# EAGLE design Mainboard (EAGLE 9.1.1)
AUTOR: Alexander Miller; PROJECT: HeRo Mini

## Sheet 1 of 4
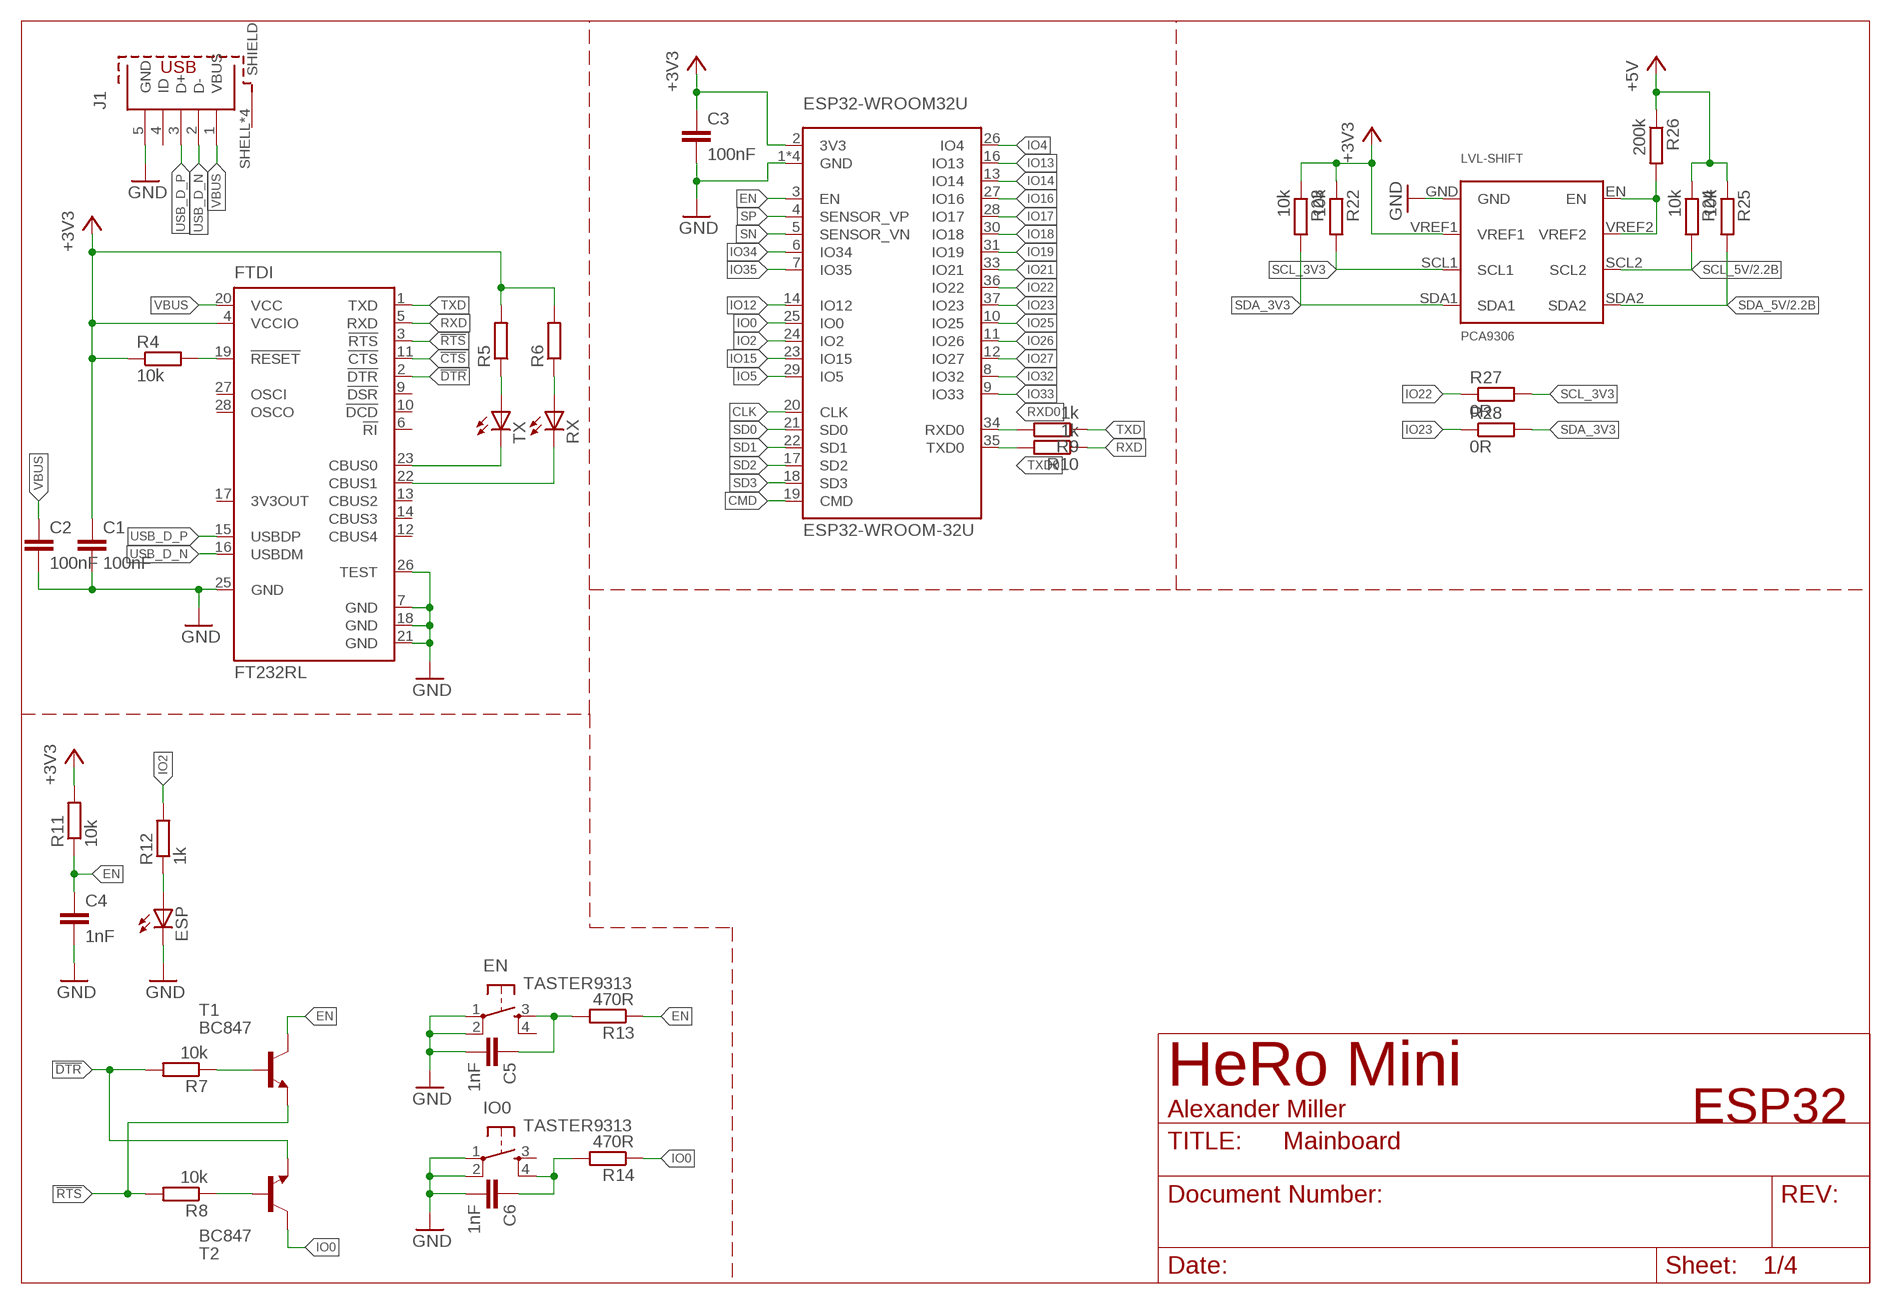
[diagram p0: schematic, sheet 1]

### Parts
C1  100nF  C-EUC0805  [C0805]
C2  100nF  C-EUC0805  [C0805]
C3  100nF  C-EUC0805  [C0805]
C4  1nF  C-EUC0805  [C0805]
C5  1nF  C-EUC0805  [C0805]
C6  1nF  C-EUC0805  [C0805]
EN  TASTER9313  [TASTER9313]
ESP  LEDCHIP-LED0805  [CHIP-LED0805]
ESP32-WROOM32U  ESP32-WROOM-32U  [ESP32-WROOM-32U]
FTDI  FT232RL  [SSOP28]
IO0  TASTER9313  [TASTER9313]
J1  629105136821  [629105136821]
LVL-SHIFT  PCA9306  [PCA9306]
R4  10k  R-EU_R0805  [R0805]
R5  R-EU_R0805  [R0805]
R6  R-EU_R0805  [R0805]
R7  10k  R-EU_R0805  [R0805]
R8  10k  R-EU_R0805  [R0805]
R9  1k  R-EU_R0805  [R0805]
R10  1k  R-EU_R0805  [R0805]
R11  10k  R-EU_R0805  [R0805]
R12  1k  R-EU_R0805  [R0805]
R13  470R  R-EU_R0805  [R0805]
R14  470R  R-EU_R0805  [R0805]
R22  10k  R-EU_R0805  [R0805]
R23  10k  R-EU_R0805  [R0805]
R24  10k  R-EU_R0805  [R0805]
R25  10k  R-EU_R0805  [R0805]
R26  200k  R-EU_R0805  [R0805]
R27  0R  R-EU_R0805  [R0805]
R28  0R  R-EU_R0805  [R0805]
RX  LEDCHIP-LED0805  [CHIP-LED0805]
T1  BC847  [SOT23]
T2  BC847  [SOT23]
TX  LEDCHIP-LED0805  [CHIP-LED0805]

### Nets
!CTS: FTDI.11(!CTS)
!DTR: FTDI.2(!DTR) R7.2 T2.2(E)
!RTS: FTDI.3(!RTS) R8.2 T1.2(E)
+3V3: C1.1 C3.1 ESP32-WROOM32U.2(3V3) FTDI.4(VCCIO) LVL-SHIFT.VREF1 R4.1 R5.2 R6.2 R11.2 R22.1 R23.1 ; also sheet 4
+5V: R24.1 R25.1 R26.1 ; also sheet 2,3,4
CLK: ESP32-WROOM32U.20(CLK)
CMD: ESP32-WROOM32U.19(CMD)
EN: C4.1 ESP32-WROOM32U.3(EN) R11.1 R13.1 T1.3(C)
GND: C1.2 C2.2 C3.2 C4.2 C5.2 C6.2 EN.1(P) EN.2(P1) ESP32-WROOM32U.1(GND) ESP32-WROOM32U.15(GND) ESP32-WROOM32U.38(GND) ESP32-WROOM32U.39(GND) ESP.C FTDI.7(GND) FTDI.18(GND) FTDI.21(GND) FTDI.25(GND) FTDI.26(TEST) IO0.1(P) IO0.2(P1) J1.5(GND) LVL-SHIFT.GND ; also sheet 2,3,4
IO0: ESP32-WROOM32U.25(IO0) R14.1 T2.3(C)
IO2: ESP32-WROOM32U.24(IO2) R12.2
IO4: ESP32-WROOM32U.26(IO4)
IO5: ESP32-WROOM32U.29(IO5)
IO12: ESP32-WROOM32U.14(IO12)
IO13: ESP32-WROOM32U.16(IO13)
IO14: ESP32-WROOM32U.13(IO14)
IO15: ESP32-WROOM32U.23(IO15)
IO16: ESP32-WROOM32U.27(IO16)
IO17: ESP32-WROOM32U.28(IO17)
IO18: ESP32-WROOM32U.30(IO18)
IO19: ESP32-WROOM32U.31(IO19)
IO21: ESP32-WROOM32U.33(IO21)
IO22: ESP32-WROOM32U.36(IO22) R27.1
IO23: ESP32-WROOM32U.37(IO23) R28.1
IO25: ESP32-WROOM32U.10(IO25)
IO26: ESP32-WROOM32U.11(IO26)
IO27: ESP32-WROOM32U.12(IO27)
IO32: ESP32-WROOM32U.8(IO32)
IO33: ESP32-WROOM32U.9(IO33)
IO34: ESP32-WROOM32U.6(IO34)
IO35: ESP32-WROOM32U.7(IO35)
N$3: FTDI.19(!RESET) R4.2
N$4: FTDI.23(CBUS0) TX.C
N$5: FTDI.22(CBUS1) RX.C
N$6: R5.1 TX.A
N$7: R6.1 RX.A
N$8: R7.1 T1.1(B)
N$9: R8.1 T2.1(B)
N$12: ESP.A R12.1
N$13: C5.1 EN.3(S) R13.2
N$14: C6.1 IO0.4(S1) R14.2
N$23: LVL-SHIFT.EN LVL-SHIFT.VREF2 R26.2
RXD: FTDI.5(RXD) R10.1
RXD0: ESP32-WROOM32U.34(RXD0) R9.2
SCL_3V3: LVL-SHIFT.SCL1 R22.2 R27.2
SCL_5V: LVL-SHIFT.SCL2 R24.2 ; also sheet 2,3
SD0: ESP32-WROOM32U.21(SD0)
SD1: ESP32-WROOM32U.22(SD1)
SD2: ESP32-WROOM32U.17(SD2)
SD3: ESP32-WROOM32U.18(SD3)
SDA_3V3: LVL-SHIFT.SDA1 R23.2 R28.2
SDA_5V: LVL-SHIFT.SDA2 R25.2 ; also sheet 2,3
SN: ESP32-WROOM32U.5(SENSOR_VN)
SP: ESP32-WROOM32U.4(SENSOR_VP)
TXD: FTDI.1(TXD) R9.1
TXD0: ESP32-WROOM32U.35(TXD0) R10.2
USB_D_N: FTDI.16(USBDM) J1.2(D-)
USB_D_P: FTDI.15(USBDP) J1.3(D+)
VBUS: C2.1 FTDI.20(VCC) J1.1(VBUS)
Unconnected: EN.4(S1) FTDI.6(!RI) FTDI.9(!DSR) FTDI.10(!DCD) FTDI.12(CBUS4) FTDI.13(CBUS2) FTDI.14(CBUS3) FTDI.17(3V3OUT) FTDI.27(OSCI) FTDI.28(OSCO) IO0.3(S) J1.4(ID) J1.SHELL1(SHIELD) J1.SHELL2(SHIELD) J1.SHELL3(SHIELD) J1.SHELL(SHIELD)

### Notes on the sheet
- ESP32

## Sheet 2 of 4
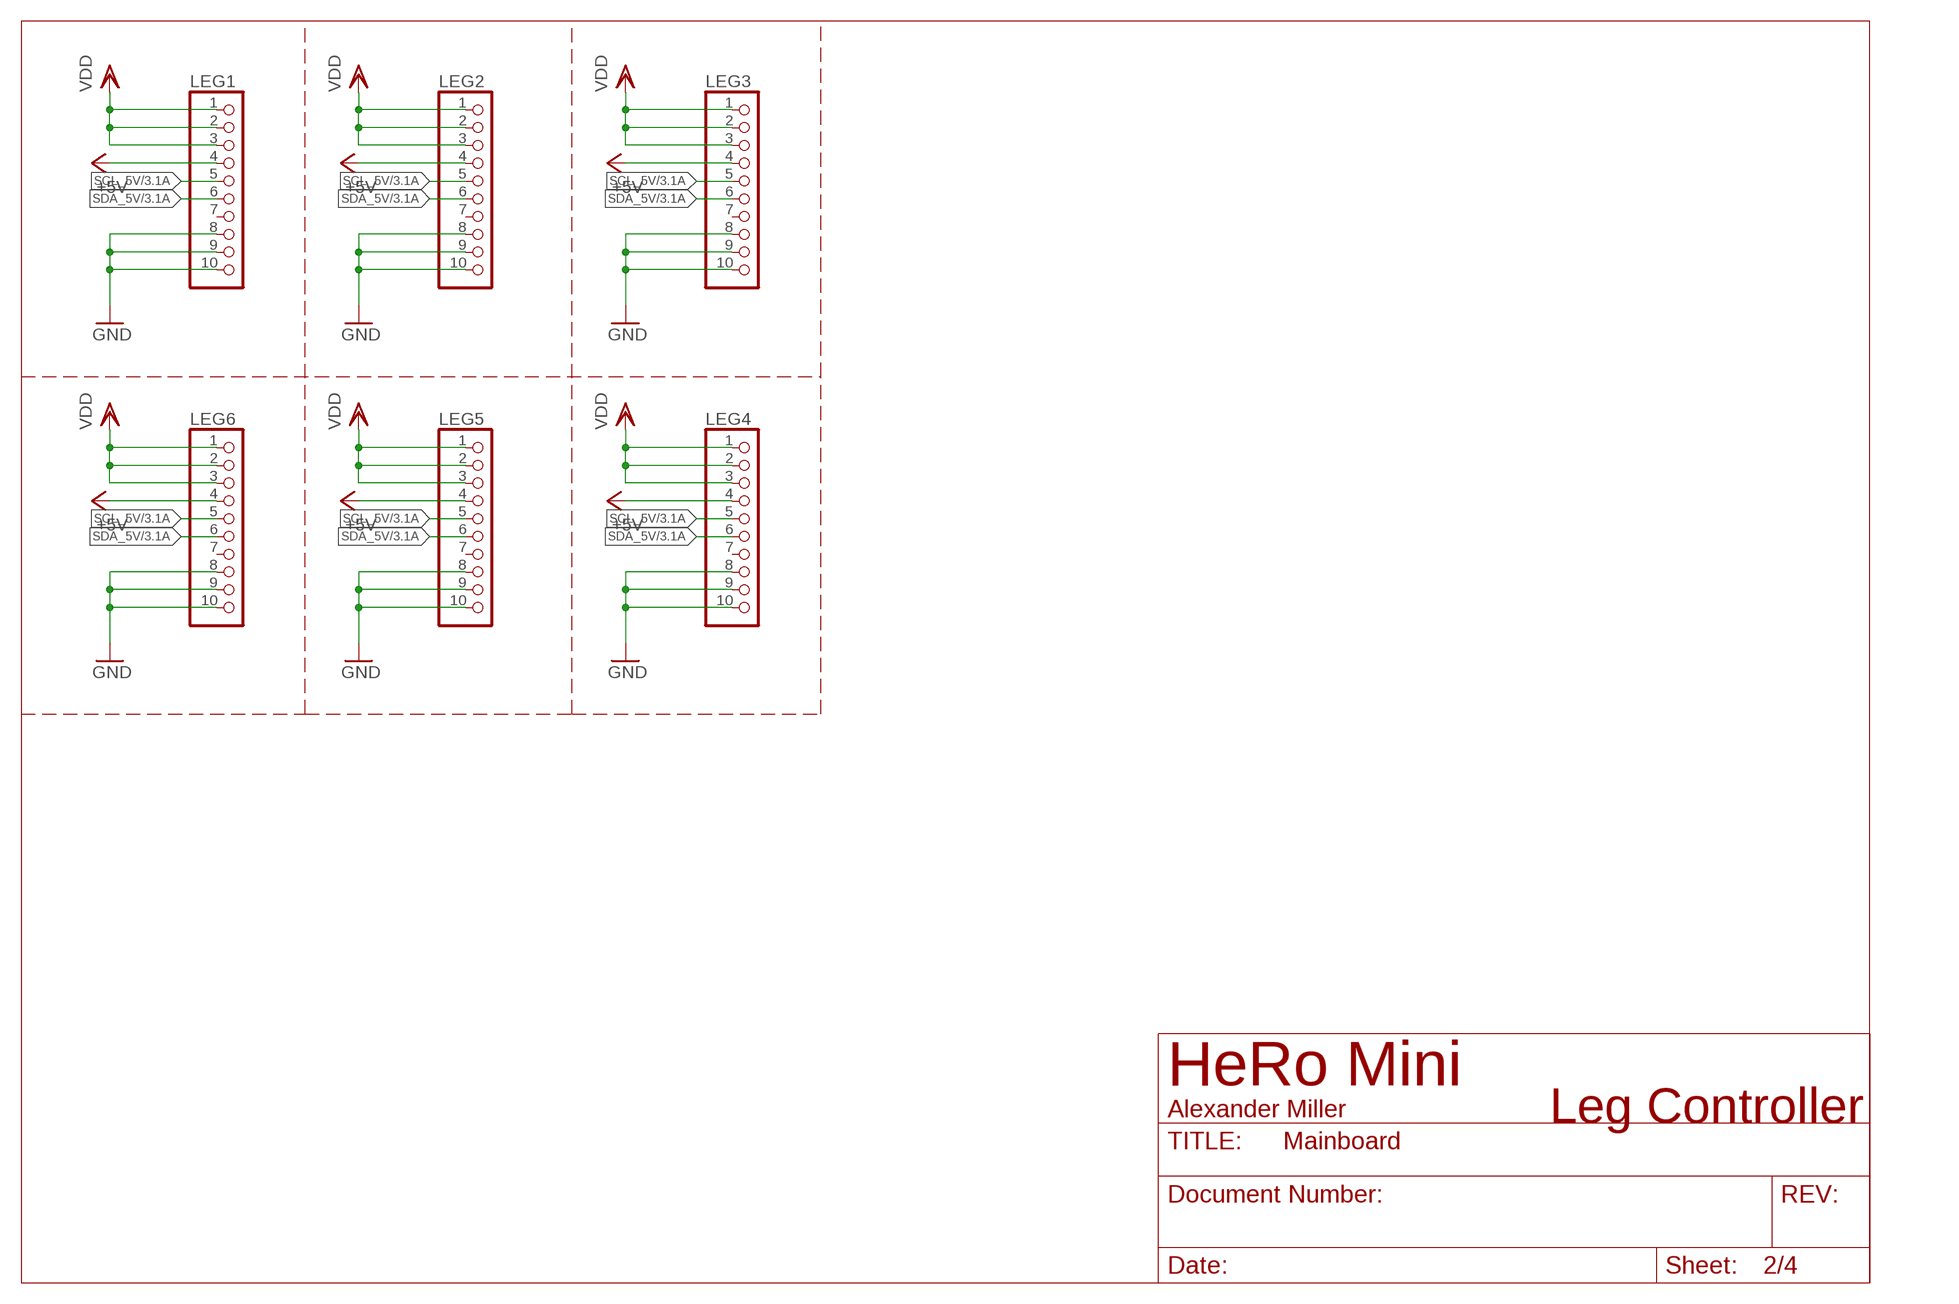
[diagram p1: schematic, sheet 2]

### Parts
LEG1  PINHD-1X10  [1X10]
LEG2  PINHD-1X10  [1X10]
LEG3  PINHD-1X10  [1X10]
LEG4  PINHD-1X10  [1X10]
LEG5  PINHD-1X10  [1X10]
LEG6  PINHD-1X10  [1X10]

### Nets
+5V: LEG1.4 LEG2.4 LEG3.4 LEG4.4 LEG5.4 LEG6.4 ; also sheet 1,3,4
GND: LEG1.8 LEG1.9 LEG1.10 LEG2.8 LEG2.9 LEG2.10 LEG3.8 LEG3.9 LEG3.10 LEG4.8 LEG4.9 LEG4.10 LEG5.8 LEG5.9 LEG5.10 LEG6.8 LEG6.9 LEG6.10 ; also sheet 1,3,4
SCL_5V: LEG1.5 LEG2.5 LEG3.5 LEG4.5 LEG5.5 LEG6.5 ; also sheet 1,3
SDA_5V: LEG1.6 LEG2.6 LEG3.6 LEG4.6 LEG5.6 LEG6.6 ; also sheet 1,3
VDD: LEG1.1 LEG1.2 LEG1.3 LEG2.1 LEG2.2 LEG2.3 LEG3.1 LEG3.2 LEG3.3 LEG4.1 LEG4.2 LEG4.3 LEG5.1 LEG5.2 LEG5.3 LEG6.1 LEG6.2 LEG6.3 ; also sheet 4
Unconnected: LEG1.7 LEG2.7 LEG3.7 LEG4.7 LEG5.7 LEG6.7

### Notes on the sheet
- Leg Controller

## Sheet 3 of 4
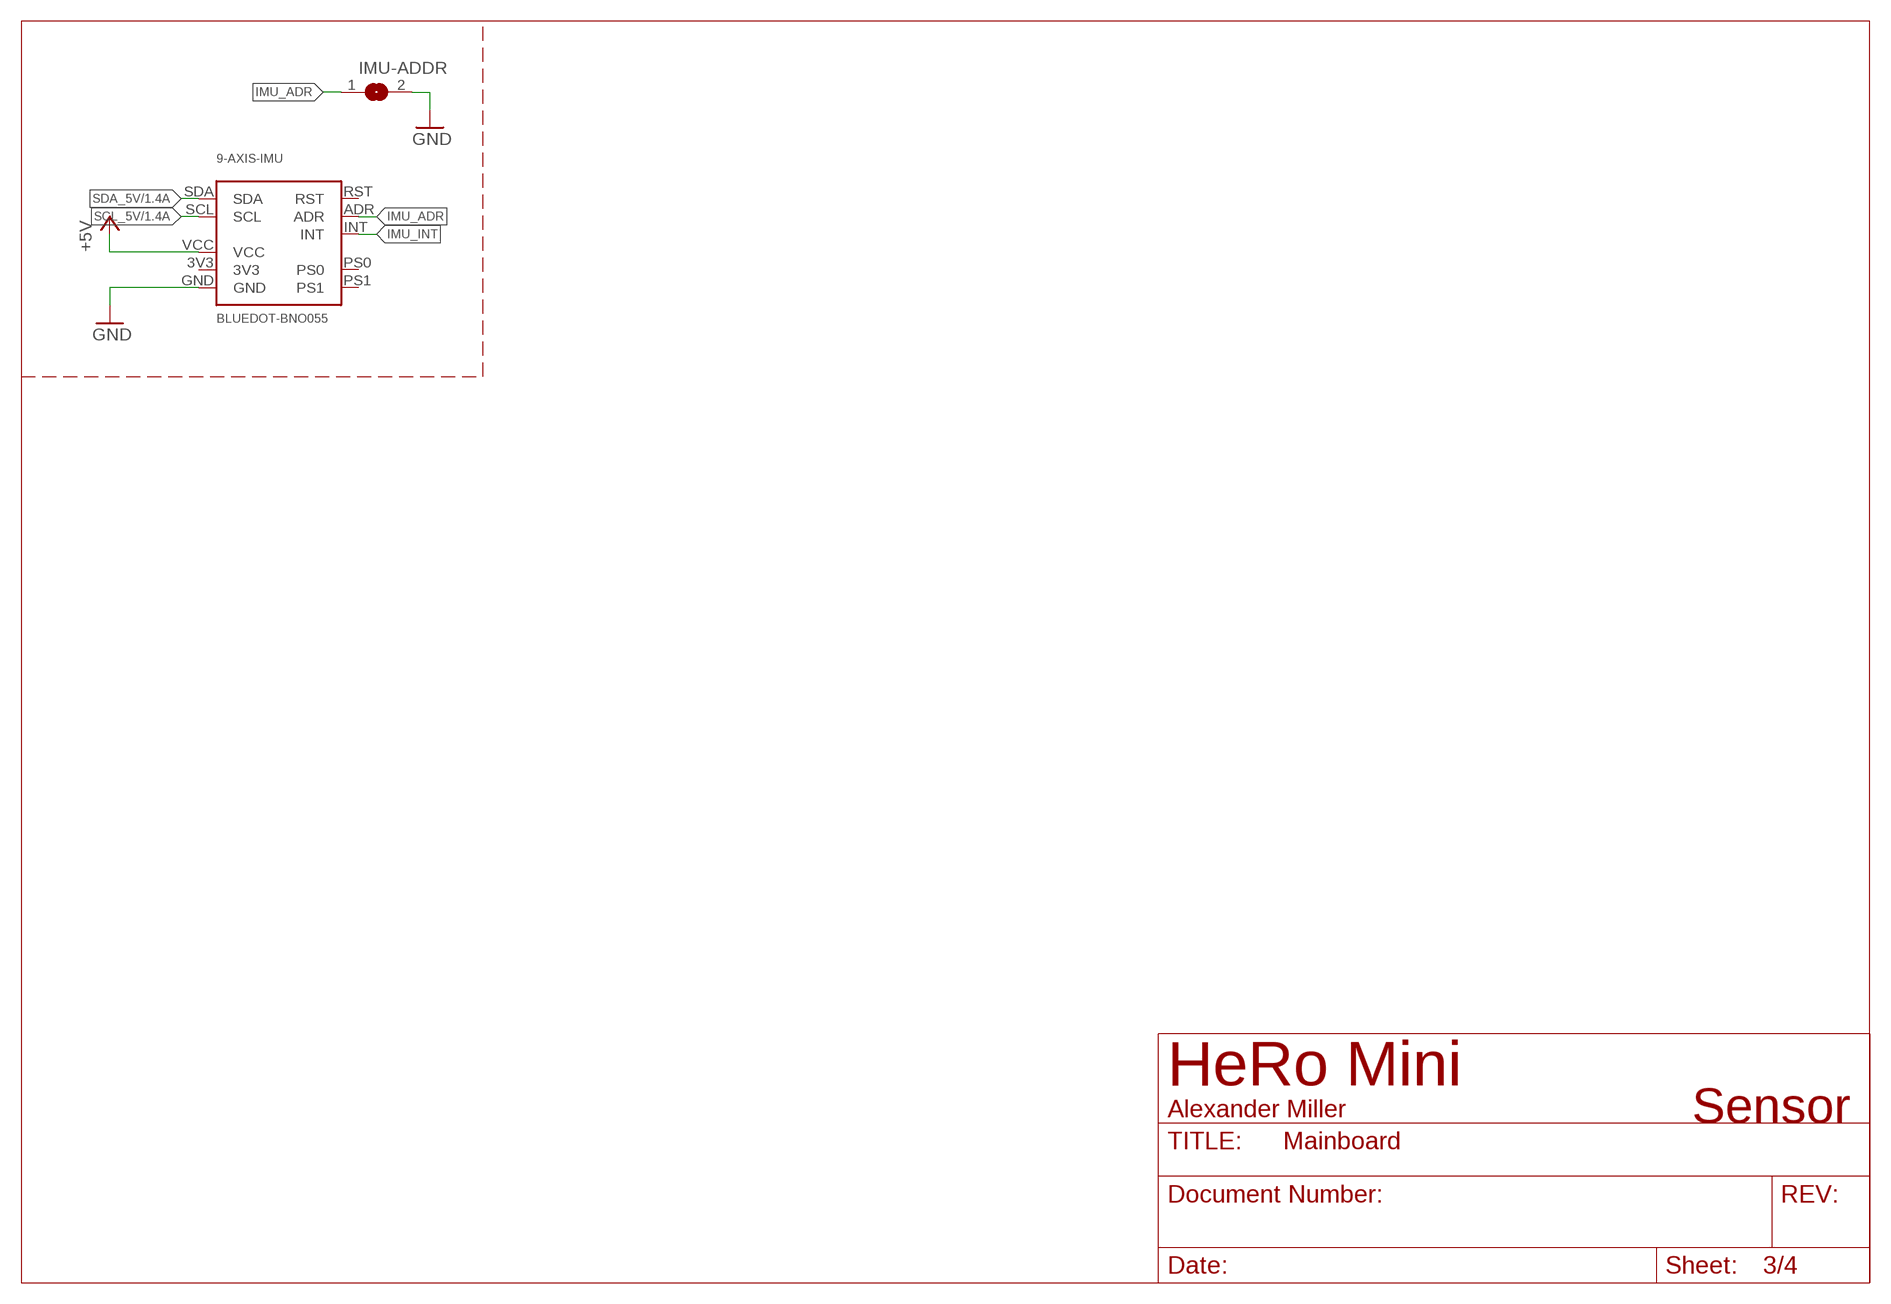
[diagram p2: schematic, sheet 3]

### Parts
9-AXIS-IMU  BLUEDOT-BNO055  [BLUEDOT-BNO055]
IMU-ADDR  SJ  [SJ]

### Nets
+5V: 9-AXIS-IMU.VCC ; also sheet 1,2,4
GND: 9-AXIS-IMU.GND IMU-ADDR.2 ; also sheet 1,2,4
IMU_ADR: 9-AXIS-IMU.ADR IMU-ADDR.1
IMU_INT: 9-AXIS-IMU.INT
SCL_5V: 9-AXIS-IMU.SCL ; also sheet 1,2
SDA_5V: 9-AXIS-IMU.SDA ; also sheet 1,2
Unconnected: 9-AXIS-IMU.3V3 9-AXIS-IMU.PS0 9-AXIS-IMU.PS1 9-AXIS-IMU.RST

### Notes on the sheet
- Sensor

## Sheet 4 of 4
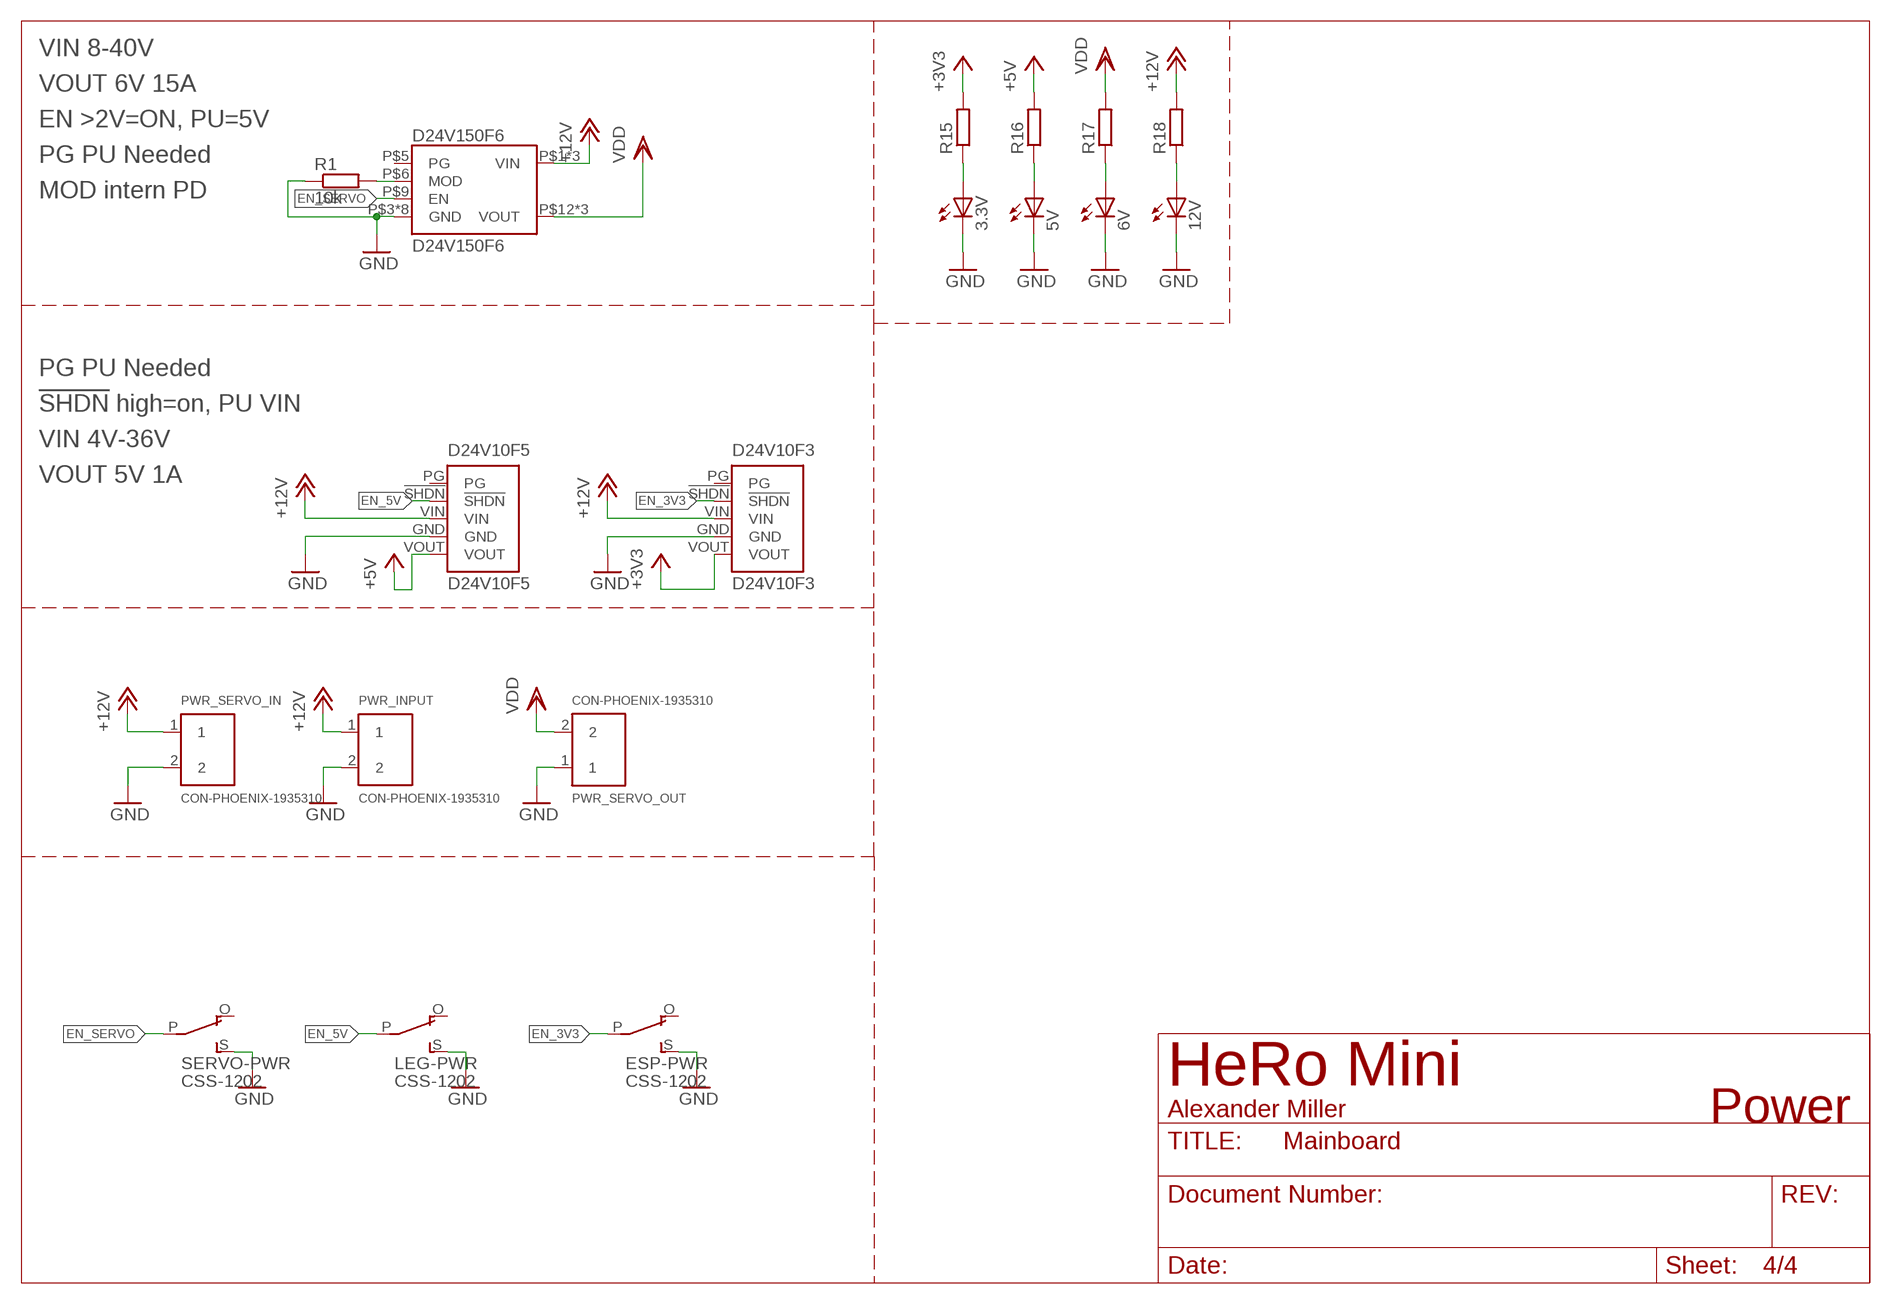
[diagram p3: schematic, sheet 4]

### Parts
3.3V  LEDCHIP-LED0805  [CHIP-LED0805]
5V  LEDCHIP-LED0805  [CHIP-LED0805]
6V  LEDCHIP-LED0805  [CHIP-LED0805]
12V  LEDCHIP-LED0805  [CHIP-LED0805]
D24V10F3  D24V10F3  [D24V10F5]
D24V10F5  D24V10F5  [D24V10F5]
D24V150F6  D24V150F6  [D24V150F6]
ESP-PWR  CSS-1202  [CSS-1202]
LEG-PWR  CSS-1202  [CSS-1202]
PWR_INPUT  CON-PHOENIX-1935310  [CON-PHOENIX-1935310]
PWR_SERVO_IN  CON-PHOENIX-1935310  [CON-PHOENIX-1935310]
PWR_SERVO_OUT  CON-PHOENIX-1935310  [CON-PHOENIX-1935310]
R1  10k  R-EU_R0805  [R0805]
R15  R-EU_R0805  [R0805]
R16  R-EU_R0805  [R0805]
R17  R-EU_R0805  [R0805]
R18  R-EU_R0805  [R0805]
SERVO-PWR  CSS-1202  [CSS-1202]

### Nets
+3V3: D24V10F3.VOUT R15.2 ; also sheet 1
+5V: D24V10F5.VOUT R16.2 ; also sheet 1,2,3
+12V: D24V10F3.VIN D24V10F5.VIN D24V150F6.P$1(VIN) D24V150F6.P$2(VIN) D24V150F6.P$17(VIN) PWR_INPUT.1 PWR_SERVO_IN.1 R18.2
EN_3V3: D24V10F3.!SHDN ESP-PWR.P
EN_5V: D24V10F5.!SHDN LEG-PWR.P
EN_SERVO: D24V150F6.P$9(EN) SERVO-PWR.P
GND: 3.3V.C 5V.C 6V.C 12V.C D24V10F3.GND D24V10F5.GND D24V150F6.P$3(GND) D24V150F6.P$4(GND) D24V150F6.P$7(GND) D24V150F6.P$8(GND) D24V150F6.P$10(GND) D24V150F6.P$11(GND) D24V150F6.P$14(GND) D24V150F6.P$16(GND) ESP-PWR.S LEG-PWR.S PWR_INPUT.2 PWR_SERVO_IN.2 PWR_SERVO_OUT.1 R1.1 SERVO-PWR.S ; also sheet 1,2,3
N$2: D24V150F6.P$6(MOD) R1.2
N$15: 5V.A R16.1
N$16: 6V.A R17.1
N$17: 3.3V.A R15.1
N$18: 12V.A R18.1
VDD: D24V150F6.P$12(VOUT) D24V150F6.P$13(VOUT) D24V150F6.P$15(VOUT) PWR_SERVO_OUT.2 R17.2 ; also sheet 2
Unconnected: D24V10F3.PG D24V10F5.PG D24V150F6.P$5(PG) ESP-PWR.O LEG-PWR.O SERVO-PWR.O

### Notes on the sheet
- VIN 8-40V
- VOUT 6V 15A
- EN >2V=ON, PU=5V
- PG PU Needed
- MOD intern PD
- PG PU Needed
- !SHDN! high=on, PU VIN
- VIN 4V-36V
- VOUT 5V 1A
- Power

## Library data of the parts
3.3V 5V 6V 12V ESP RX TX = led:LED: LED OSRAM: - CHIPLED LG R971, LG N971, LY N971, LG Q971, LY Q971, LO R971, LY R971 LH N974, LH R974 LS Q976, LO Q976, LY Q976 LO Q996 - Hyper CHIPLED LW Q18S LB Q993, LB Q99A, LB R99A - SideLED LS A670, LO A670, LY A670, LG A670, LP A670 LB A673, LV A673, LT A673, LW A673 LH A674 LY A675 LS A676, LA A676, LO A676, LY A676, LW A676 LS A679, LY A679, LG A679 - Hyper Micro SIDELED® LS Y876, LA Y876, LO Y876, LY Y876 LT Y87S - SmartLED LW L88C, LW L88S LB L89C, LB L89S, LG L890 LS L89K, LO L89K, LY L89K LS L896, LA L896, LO L896, LY L896 - TOPLED LS T670, LO T670, LY T670, LG T670, LP T670 LSG T670, LSP T670, LSY T670, LOP T670, LYG T670 LG T671, LOG T671, LSG T671 LB T673, LV T673, LT T673, LW T673 LH T674 LS T676, LA T676, LO T676, LY T676, LB T676, LH T676, LSB T676, LW T676 LB T67C, LV T67C, LT T67C, LS T67K, LO T67K, LY T67K, LW E67C LS E67B, LA E67B, LO E67B, LY E67B, LB E67C, LV E67C, LT E67C LW T67C LS T679, LY T679, LG T679 LS T770, LO T770, LY T770, LG T770, LP T770 LB T773, LV T773, LT T773, LW T773 LH T774 LS E675, LA E675, LY E675, LS T675 LS T776, LA T776, LO T776, LY T776, LB T776 LHGB T686 LT T68C, LB T68C - Hyper Mini TOPLED® LB M676 - Mini TOPLED Santana® LG M470 LS M47K, LO M47K, LY M47K Source: http://www.osram.convergy.de LUXEON: - LUMILED® LXK2-PW12-R00, LXK2-PW12-S00, LXK2-PW14-U00, LXK2-PW14-V00 LXK2-PM12-R00, LXK2-PM12-S00, LXK2-PM14-U00 LXK2-PE12-Q00, LXK2-PE12-R00, LXK2-PE12-S00, LXK2-PE14-T00, LXK2-PE14-U00 LXK2-PB12-K00, LXK2-PB12-L00, LXK2-PB12-M00, LXK2-PB14-N00, LXK2-PB14-P00, LXK2-PB14-Q00 LXK2-PR12-L00, LXK2-PR12-M00, LXK2-PR14-Q00, LXK2-PR14-R00 LXK2-PD12-Q00, LXK2-PD12-R00, LXK2-PD12-S00 LXK2-PH12-R00, LXK2-PH12-S00 LXK2-PL12-P00, LXK2-PL12-Q00, LXK2-PL12-R00 Source: www.luxeon.com KINGBRIGHT: KA-3528ASYC Source: www.kingbright.com
9-AXIS-IMU = HeRo:BLUEDOT-BNO055
C1-C6 = rcl:C-EU: CAPACITOR, European symbol; SPICEPREFIX: C
D24V10F3 = HeRo:D24V10F3
D24V10F5 = HeRo:D24V10F5
D24V150F6 = HeRo:D24V150F6
EN IO0 = HeRo:TASTER9313
ESP32-WROOM32U = HeRo:ESP32-WROOM-32U
ESP-PWR LEG-PWR SERVO-PWR = HeRo:CSS-1202
FTDI = ftdichip:FT232R: Source: http://www.ftdichip.com/Documents/DataSheets/DS_FT232R_v104.pdf; MPN: FT232RL; OC_FARNELL: 1146032; OC_NEWARK: 91K9918
IMU-ADDR = jumper:SJ: SMD solder JUMPER
J1 = InputOutputIO (rev18a):629105136821: WR-COM SMT Horizontal 5 Contacts Micro USB Type B,5 pins=>Code : Con_I-O_COM_MicroUSB_629105136821 <http://katalog.we-online.de/media/images/eican/Con_I-O_COM_MicroUSB_629105136821_pf2.jpg> Details see: http://katalog.we-online.de/en/em/COM_MICRO_SMT_TYPE_B_HORIZONTAL/629105136821?m Created 2014-07-09, Karrer Zheng 2014 (C) Würth Elektronik
LEG1-LEG6 = pinhead:PINHD-1X10: PIN HEADER
LVL-SHIFT = HeRo:PCA9306
PWR_INPUT PWR_SERVO_IN PWR_SERVO_OUT = HeRo:CON-PHOENIX-1935310
R1 R4-R18 R22-R28 = rcl:R-EU_: RESISTOR, European symbol; SPICEPREFIX: R
T1 T2 = transistor:BC847: NPN TRANSISTOR

## Board
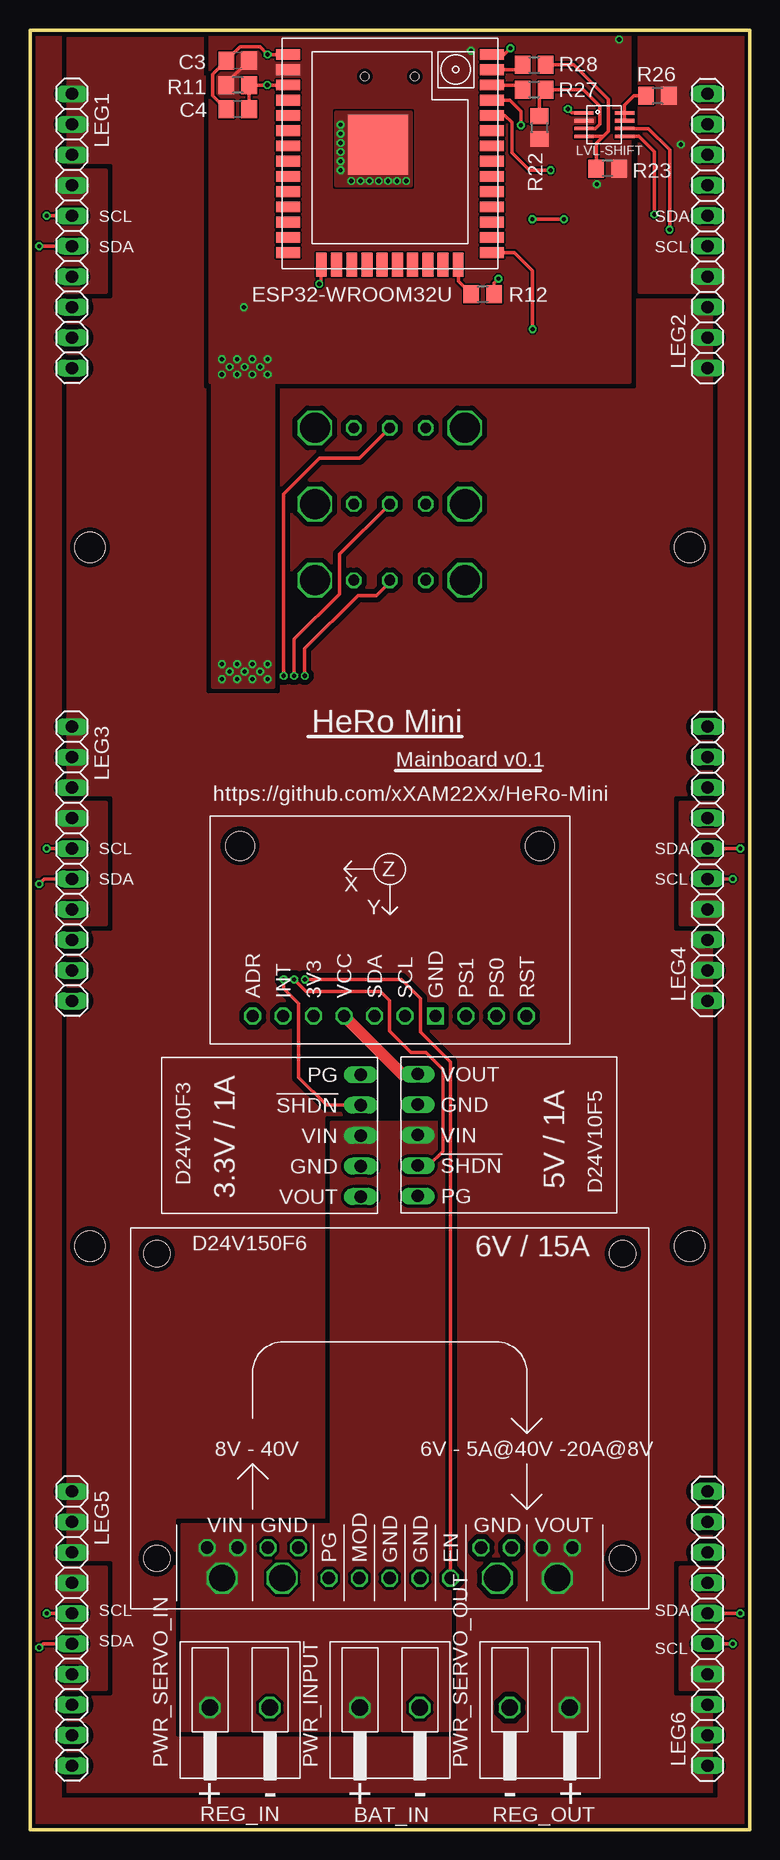
[diagram p4: board, top side]
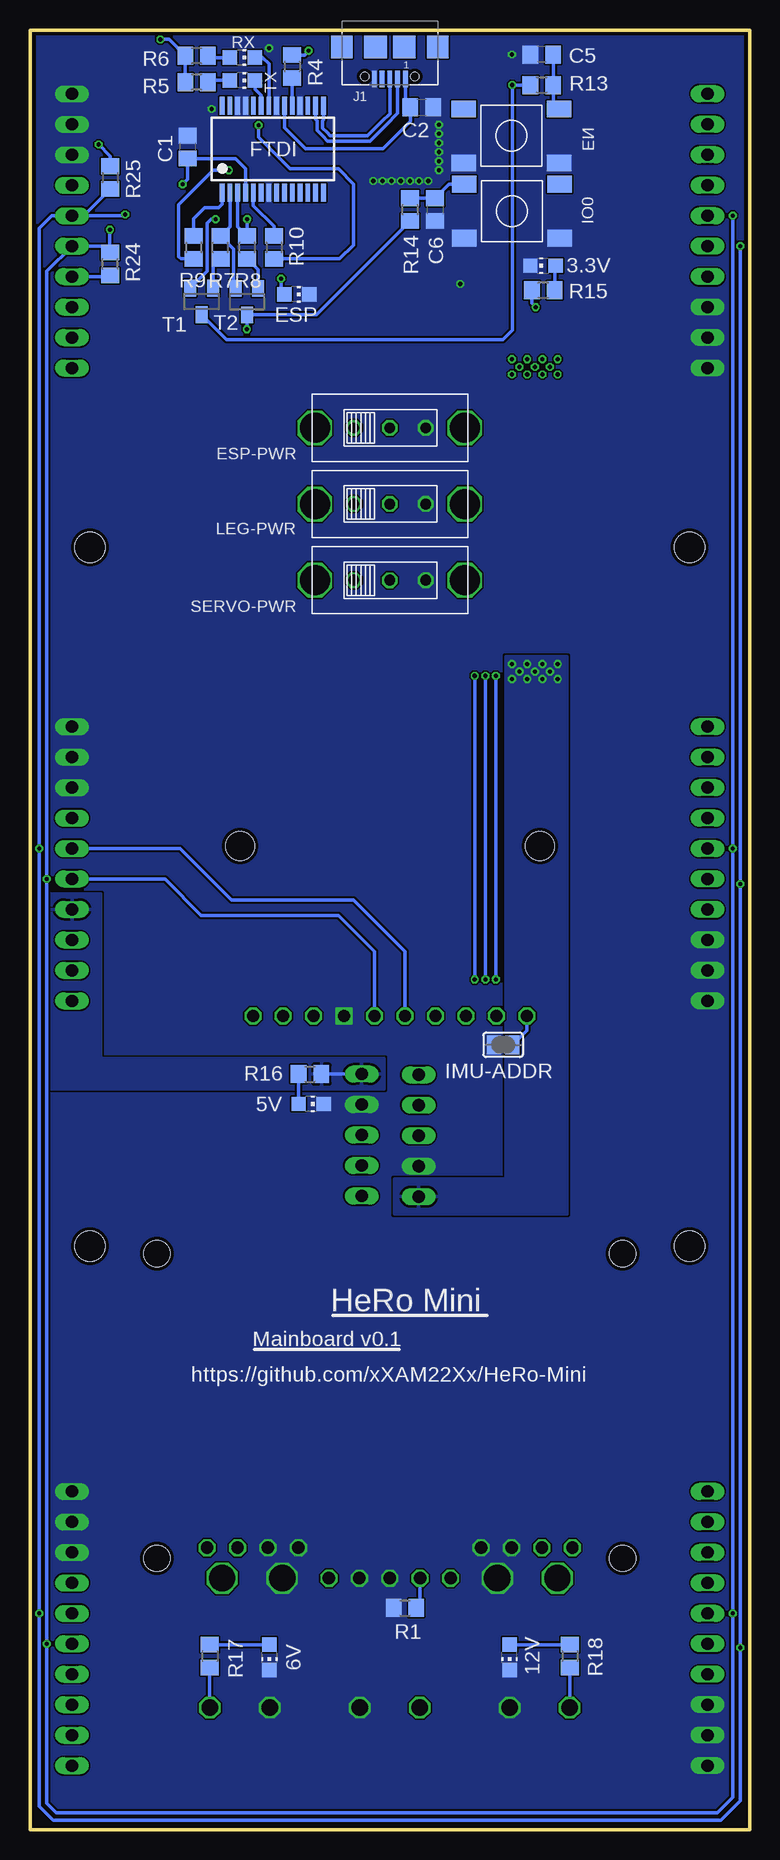
[diagram p5: board, bottom side, seen from below]

Size 60 x 150 mm. Coordinates in mm from the lower left corner, seen from the top.
Outline: 0,0 0,150 60,150 60,0 0,0
Copper layers (1*16): Top 0.035mm / dielectric 1.5mm / Bottom 0.035mm
Design rules "PCB-POOL Standard": minimum track width 0.15mm, minimum drill 0.3mm, track to track 0.15mm, track to pad 0.15mm, pad to pad 0.15mm, via to via 0.15mm, smd to smd 0.15mm, copper to edge 0.3mm, drill to drill 0.2mm, minimum pad ring 0.2mm, minimum via ring 0.15mm, stop-mask expansion 0.075mm, vias tented up to drill 0mil, thermal gap 0.2mm
Holes 2.5 mm at 5,106.88 55,106.88 5,48.62 55,48.62

### Footprints (pad centres in the part's own frame; a part is rotated, then mirrored left to right if it is on the bottom)
CHIP-LED0805 = smd 1.2 x 1.2: A 0,-1.05; C 0,1.05
BLUEDOT-BNO055 = drill 1.016 octagon: 3V3 -6.35,-7.2; ADR -11.43,-7.2; INT -8.89,-7.2; PS0 8.89,-7.2; PS1 6.35,-7.2; RST 11.4,-7.2; SCL 1.27,-7.2; SDA -1.27,-7.2; VCC -3.81,-7.2 | drill 1.016 square: GND 3.81,-7.2 | hole 2.4: -12.5,7; 12.5,7
C0805 = smd 1.3 x 1.5: 1 -0.95,0; 2 0.95,0
D24V10F5 = drill 1.016 long: !SHDN 2.54,-7.62; GND -2.54,-7.62; PG 5.08,-7.62; VIN 0,-7.62; VOUT -5.08,-7.62
D24V150F6 = drill 1.016 octagon: P$1 -15.24,-10.795; P$2 -12.7,-10.795; P$3 -10.16,-10.795; P$4 -7.62,-10.795; P$5 -5.08,-13.335; P$6 -2.54,-13.335; P$7 0,-13.335; P$8 2.54,-13.335; P$9 5.08,-13.335; P$10 7.62,-10.795; P$11 10.16,-10.795; P$12 12.7,-10.795; P$13 15.24,-10.795 | drill 2.184 octagon: P$14 8.966,-13.335; P$15 13.97,-13.335; P$16 -8.966,-13.335; P$17 -13.97,-13.335 | hole 2.184: -19.431,13.716; -19.431,-11.684; 19.431,-11.684; 19.431,13.716
TASTER9313 = smd 2.05 x 1.4: 1 -3.975,2.25; 2 3.975,2.25; 3 -3.975,-2.25; 4 3.975,-2.25
ESP32-WROOM-32U = smd 2 x 0.9: 1 -8.5,8.255; 2 -8.5,6.985; 3 -8.5,5.715; 4 -8.5,4.445; 5 -8.5,3.175; 6 -8.5,1.905; 7 -8.5,0.635; 8 -8.5,-0.635; 9 -8.5,-1.905; 10 -8.5,-3.175; 11 -8.5,-4.445; 12 -8.5,-5.715; 13 -8.5,-6.985; 14 -8.5,-8.255; 25 8.5,-8.255; 26 8.5,-6.985; 27 8.5,-5.715; 28 8.5,-4.445; 29 8.5,-3.175; 30 8.5,-1.905; 31 8.5,-0.635; 32 8.5,0.635; 33 8.5,1.905; 34 8.5,3.175; 35 8.5,4.445; 36 8.5,5.715; 37 8.5,6.985; 38 8.5,8.255 | smd 0.9 x 2: 15 -5.715,-9.255; 16 -4.445,-9.255; 17 -3.175,-9.255; 18 -1.905,-9.255; 19 -0.635,-9.255; 20 0.635,-9.255; 21 1.905,-9.255; 22 3.175,-9.255; 23 4.445,-9.255; 24 5.715,-9.255 | smd 5 x 5: 39 -1,0.755
CSS-1202 = drill 2.5 octagon: CASE1 -6.25,0; CASE2 6.25,0 | drill 0.9 octagon: O -3,0; P 0,0; S 3,0
SSOP28 = smd 0.4 x 1.5: 1 -4.225,-3.625; 2 -3.575,-3.625; 3 -2.925,-3.625; 4 -2.275,-3.625; 5 -1.625,-3.625; 6 -0.975,-3.625; 7 -0.325,-3.625; 8 0.325,-3.625; 9 0.975,-3.625; 10 1.625,-3.625; 11 2.275,-3.625; 12 2.925,-3.625; 13 3.575,-3.625; 14 4.225,-3.625; 15 4.225,3.625; 16 3.575,3.625; 17 2.925,3.625; 18 2.275,3.625; 19 1.625,3.625; 20 0.975,3.625; 21 0.325,3.625; 22 -0.325,3.625; 23 -0.975,3.625; 24 -1.625,3.625; 25 -2.275,3.625; 26 -2.925,3.625; 27 -3.575,3.625; 28 -4.225,3.625
SJ = smd 1.168 x 1.6: 1 -0.762,0; 2 0.762,0
629105136821 = smd 0.4 x 1.35: 1 -1.3,2.675; 2 -0.65,2.675; 3 0,2.675; 4 0.65,2.675; 5 1.3,2.675 | smd 1.8 x 1.9: SHELL -4,0; SHELL3 4,0 | smd 1.9 x 1.9: SHELL1 -1.2,0; SHELL2 1.2,0 | hole 0.7: -2.075,2.45; 2.075,2.45
1X10 = drill 1.016 long: 1 -11.43,0; 2 -8.89,0; 3 -6.35,0; 4 -3.81,0; 5 -1.27,0; 6 1.27,0; 7 3.81,0; 8 6.35,0; 9 8.89,0; 10 11.43,0
PCA9306 = smd 0.3 x 1.6: EN -0.975,1.7; GND -0.975,-1.7; SCL1 0.325,-1.7; SCL2 0.325,1.7; SDA1 0.975,-1.7; SDA2 0.975,1.7; VREF1 -0.325,-1.7; VREF2 -0.325,1.7
CON-PHOENIX-1935310 = drill 1.4 octagon: 1 -2.5,0; 2 2.5,0
R0805 = smd 1.3 x 1.5: 1 -0.95,0; 2 0.95,0
SOT23 = smd 1 x 1.4: 1 -0.95,-1.1; 2 0.95,-1.1; 3 0,1.1

### Placement (x,y rotation side)
3.3V  17.22,130.35 90 bottom
5V  36.55,60.48 270 bottom
6V  40.03,14.35 180 bottom
9-AXIS-IMU  30,75 0 top
12V  20.02,14.35 180 bottom
C1  46.84,140.23 90 bottom
C2  27.33,143.56 0 bottom
C3  17.32,147.45 180 top
C4  17.32,143.38 180 top
C5  17.32,147.96 180 bottom
C6  26.24,135.03 270 bottom
D24V10F3  19.96,57.84 90 top
D24V10F5  39.95,57.89 270 top
D24V150F6  30,34.29 0 top
EN  19.86,141.17 180 bottom
ESP  37.74,127.97 270 bottom
ESP32-WROOM32U  30,139.7 0 top
ESP-PWR  30,116.84 0 bottom
FTDI  39.75,140.08 0 bottom
IMU-ADDR  20.55,65.41 180 bottom
IO0  19.81,134.9 180 bottom
J1  30,148.59 180 bottom
LEG1  3.5,133.25 270 top
LEG2  56.5,133.25 90 top
LEG3  3.5,80.5 270 top
LEG4  56.5,80.5 90 top
LEG5  3.5,16.75 270 top
LEG6  56.5,16.75 90 top
LEG-PWR  30,110.49 0 bottom
LVL-SHIFT  47.88,142.11 270 top
PWR_INPUT  30,10.16 0 top
PWR_SERVO_IN  17.5,10.16 0 top
PWR_SERVO_OUT  42.5,10.16 0 top
R1  28.73,18.47 0 bottom
R4  38.13,146.96 270 bottom
R5  46.1,145.64 180 bottom
R6  46.1,147.85 180 bottom
R7  44.12,131.88 90 bottom
R8  41.88,131.88 90 bottom
R9  46.35,131.88 270 bottom
R10  39.65,131.88 270 bottom
R11  17.32,145.41 180 top
R12  37.74,127.97 180 top
R13  17.32,145.41 0 bottom
R14  28.3,135.03 90 bottom
R15  17.2,128.3 180 bottom
R16  36.65,62.97 0 bottom
R17  45.01,14.45 270 bottom
R18  14.99,14.45 270 bottom
R22  42.49,141.86 90 top
R23  48.16,138.46 180 top
R24  53.31,130.51 90 bottom
R25  53.31,137.69 270 bottom
R26  52.32,144.53 180 top
R27  42.04,145.03 0 top
R28  42.04,147.09 0 top
RX  42.29,147.7 270 bottom
SERVO-PWR  30,104.14 0 bottom
T1  45.69,127.38 180 bottom
T2  41.91,127.36 180 bottom
TX  42.29,145.8 270 bottom

### Tracks (layer width: path | path; a pad name or v marks a point on that pad's centre or on a via)
!DTR
  Bottom 0.305: FTDI.2 43.33,133.62 R7.2 43,131.71 43,128.6 T2.2
!RTS  (via drill 0.35)
  Top 0.305: v41.88,134.24 v44.53,134.24
  Bottom 0.305: FTDI.3 42.68,133.62 R8.2 v41.88,134.24 | v44.53,134.24 44.88,134.24 45.24,133.88 45.24,129.89 T1.2
+3V3  (via drill 0.35)
  Top 0.305: C3.1 16.37,145.55 R11.2
  Bottom 0.305: R4.1 37.12,147.91 v36.78,148.26 | v49.12,149.21 48.41,149.21 R6.2 R5.2 | FTDI.4 42.03,138.44 42.43,138.85 42.87,139.28 C1.1 46.84,137.57 v47.27,137.13 | R15.2 18.15,127.21 v17.83,126.9
  other vias: 16,122.56 17.27,122.56 18.54,122.56 19.81,122.56 19.81,121.28 18.54,121.28 17.27,121.28 16,121.28 16.64,121.92 17.91,121.92 19.18,121.92 16,97.16 17.27,97.16 18.54,97.16 19.81,97.16 19.81,95.89 18.54,95.89 17.27,95.89 16,95.89 16.64,96.52 17.91,96.52 19.18,96.52
  pour Top (rank 2, no thermals): 15,150 50,150 50,120.65 15,120.65
  pour Bottom: 15.24,97.79 20.32,97.79 20.32,54.23 29.59,54.23 29.59,51.31 15.24,51.31
  pour Top: 15.24,95.25 15.24,123.19 20.32,123.19 20.32,95.25
+5V  (via drill 0.35)
  Top 1.016: D24V10F5.VOUT 31.02,62.97 9-AXIS-IMU.VCC
  Bottom 0.305: R16.2 D24V10F5.VOUT | R25.1 53.31,139.5 v54.28,140.46 | R24.1 53.43,129.44 LEG2.4
  pour Top (no thermals): 2.54,150 0,150 0,0 60,0 60,150 57.46,150 50.8,150 50.8,128.14 57.46,128.14 57.46,85.6 54.23,85.6 54.23,75.44 57.46,75.44 57.46,21.84 54.23,21.84 54.23,11.68 57.46,11.68 57.46,2.54 2.54,2.54 2.54,11.68 6.35,11.68 6.35,21.84 2.54,21.84 2.54,75.44 6.35,75.44 6.35,85.6 2.54,85.6 2.54,128.14 6.35,128.14 6.35,138.3 2.54,138.3 2.54,148.59
  pour Bottom: 30.48,64.26 54.1,64.26 54.1,77.98 60,77.98 60,61.72 30.48,61.72
+12V
  Bottom 0.305: R18.2 14.99,10.17 PWR_SERVO_IN.1
  pour Top (isolate 0.254, no thermals): 12.7,25.4 25.15,25.4 25.15,58.93 35,58.93 35,30.48 35,16.51 35,8.26 12.7,8.26
EN  (via drill 0.35)
  Top 0.305: ESP32-WROOM32U.3 v19.79,145.41 R13.1 C4.1
  Bottom 0.305: T1.3 43.62,124.21 20.57,124.21 19.79,124.99 v19.79,145.41 R13.1
EN_3V3  (via drill 0.35)
  Top 0.305: D24V10F3.!SHDN 24.71,60.38 22.4,62.69 22.4,68.86 21.16,70.1 v21.16,70.87 | v21.16,96.16 21.16,111.33 24.13,114.3 27.46,114.3 ESP-PWR.P
  Bottom 0.305: v21.16,70.87 v21.16,96.16
EN_5V  (via drill 0.35)
  Top 0.305: D24V10F5.!SHDN 33.25,55.35 34.42,56.52 34.42,63.37 33.02,64.77 31.75,64.77 29.97,66.55 29.97,69.09 29.21,69.85 23.04,69.85 v22.02,70.87 | v22.02,96.16 22.02,99.21 25.81,103 25.81,105.41 25.81,106.3 LEG-PWR.P
  Bottom 0.305: v22.02,70.87 v22.02,96.16
EN_SERVO  (via drill 0.35)
  Top 0.305: D24V150F6.P$9 35.08,63.98 32.56,66.5 32.56,69.27 30.96,70.86 v22.91,70.86 | v22.91,96.16 22.91,98.42 27.36,102.87 28.91,102.87 30,103.97 SERVO-PWR.P
  Bottom 0.305: v22.91,70.86 v22.91,96.16
GND  (via drill 0.35)
  Top 0.305: ESP32-WROOM32U.1 v19.81,147.96 19.18,148.59 17.52,148.59 C3.2 15.24,146.31 15.24,144.52 C4.2 | ESP32-WROOM32U.15 24.29,128.98 v24.13,128.83 | ESP32-WROOM32U.38 39.52,147.96 v40.06,148.49 | LVL-SHIFT.GND 45.18,143.09 v44.86,143.41
  other vias: 25.91,142.11 25.91,141.35 25.91,140.59 25.91,139.83 25.91,139.06 25.91,138.3 26.8,137.41 27.56,137.41 28.32,137.41 29.08,137.41 29.84,137.41 30.61,137.41 31.37,137.41
  pour Bottom (rank 6, no thermals): 0,150 60,150 60,0 0,0
  pour Top (no thermals): 25.53,143.13 31.75,143.13 31.75,137.03 25.53,137.03
IMU_ADR
  Bottom 0.305: 9-AXIS-IMU.ADR 18.57,66.62 IMU-ADDR.1
IO0  (via drill 0.35)
  Top 0.305: v41.91,125.07 41.91,129.92 40.39,131.44 ESP32-WROOM32U.25
  Bottom 0.305: v41.91,125.07 T2.3 36.12,126.26 R14.1
IO2
  Top 0.305: ESP32-WROOM32U.24 35.72,129.04 R12.2
IO22
  Top 0.305: ESP32-WROOM32U.36 40.71,145.41 R27.1
IO23
  Top 0.305: ESP32-WROOM32U.37 40.68,146.69 R28.1
N$2
  Bottom 0.305: D24V150F6.P$6 27.46,18.78 R1.2
N$3
  Bottom 0.305: FTDI.19 R4.2
N$4
  Bottom 0.305: TX.C 41.24,145.08 40.73,144.56 FTDI.23
N$5
  Bottom 0.305: RX.C 40.62,147.7 40.08,147.17 FTDI.22
N$6
  Bottom 0.305: TX.A 45,145.8 R5.1
N$7
  Bottom 0.305: RX.A 45,147.7 R6.1
N$8
  Bottom 0.305: R7.1 44.74,130.3 T1.1
N$9
  Bottom 0.305: R8.1 40.96,130 T2.1
N$12  (via drill 0.35)
  Top 0.305: R12.1 38.69,128.89 v39.06,129.26
  Bottom 0.305: v39.06,129.26 39.06,128.24 ESP.A
N$13
  Bottom 0.305: C5.1 R13.2 16.37,143.91 EN.3
N$14
  Bottom 0.305: IO0.4 25.07,137.15 C6.1 R14.2
N$15
  Bottom 0.305: 5V.A R16.1
N$16
  Bottom 0.305: 6V.A R17.1
N$17
  Bottom 0.305: R15.1 16.25,130.28 3.3V.A
N$18
  Bottom 0.305: R18.1 12V.A
N$23
  Top 0.305: LVL-SHIFT.VREF2 LVL-SHIFT.EN 49.58,143.74 50.37,144.53 R26.2
RXD
  Bottom 0.305: FTDI.5 41.38,135.36 39.65,133.63 R10.1
RXD0  (via drill 0.35)
  Top 0.305: ESP32-WROOM32U.34 39.62,142.88 40.18,142.32 40.18,139.78 41.66,138.3 v43.41,138.3
  Bottom 0.305: R9.2 47.41,130.93 47.6,131.12 47.6,135.43 44.73,138.3 v43.41,138.3
SCL_3V3
  Top 0.305: R22.2 42.49,144.54 R27.2 46.15,145.03 47.52,143.66 47.52,142.16 47.15,141.79 LVL-SHIFT.SCL1
SCL_5V  (via drill 0.35)
  Top 0.305: v1.4,134.52 LEG1.5 | v1.41,81.76 LEG3.5 | v1.41,18.01 3.49,18.01 LEG5.5 | v58.59,15.47 56.51,15.47 LEG6.5 | v58.59,79.22 58.59,79.23 LEG4.5 | LVL-SHIFT.SCL2 51.56,141.79 53.34,140 v53.34,133.35
  Bottom 0.305: 9-AXIS-IMU.SCL 31.27,73.18 34.29,76.2 45.72,76.2 48.75,79.23 LEG4.5 | v53.34,133.35 53.34,131.48 | 53.34,131.48 R24.2 | 53.34,131.48 53.84,131.98 LEG2.5 58.59,129.88 v58.59,79.22 v58.59,15.47 58.59,2.19 58.26,1.86 57.8,1.41 56.59,1.41 2.67,1.41 1.72,2.36 1.41,2.67 v1.41,18.01 v1.41,81.76 v1.41,134.51 v1.4,134.52
SDA_3V3
  Top 0.305: R28.2 45.36,147.09 48.23,144.22 48.23,141.58 47.79,141.14 | LVL-SHIFT.SDA1 47.79,141.14 | R23.2 47.21,140.55 47.79,141.14
SDA_5V  (via drill 0.35)
  Top 0.305: v0.78,131.98 LEG1.6 | v0.78,78.82 1.19,79.23 LEG3.6 | v0.78,15.16 1.09,15.48 LEG5.6 | v59.22,18.01 56.51,18.01 LEG6.6 | v59.22,81.76 v59.22,81.77 LEG4.6 | LVL-SHIFT.SDA2 50.78,141.14 52.07,139.85 v52.07,134.62
  Bottom 0.305: 9-AXIS-IMU.SDA 28.73,73.18 33.02,77.47 43.18,77.47 47.48,81.77 LEG4.6 | v52.07,134.62 52.17,134.52 LEG2.6 | R25.2 55.54,134.52 LEG2.6 | LEG2.6 58.18,134.52 59.22,133.48 v59.22,81.76 v59.22,18.01 59.22,1.94 58.06,0.78 2.41,0.78 0.78,2.41 v0.78,15.16 v0.78,78.82 v0.78,131.98
TXD
  Bottom 0.305: FTDI.1 43.98,135.47 44.27,135.18 45.44,135.18 46.35,134.26 R9.1
TXD0  (via drill 0.35)
  Top 0.305: v40.95,142.06 40.95,143.23 40.03,144.15 ESP32-WROOM32U.35
  Bottom 0.305: R10.2 34.17,130.93 33.02,132.08 33.02,137.16 34.29,138.43 38.33,138.43 40.95,141.05 v40.95,142.06
USB_D_N
  Bottom 0.305: J1.2 29.35,143.05 30.32,142.08 31.66,140.74 34.29,140.74 35.17,140.74 35.57,141.14 36.07,141.64 36.07,142.44 36.18,142.55 FTDI.16
USB_D_P
  Bottom 0.305: J1.3 30,143.04 30.64,142.4 31.84,141.2 34.29,141.2 34.98,141.2 35.25,141.46 35.61,141.83 35.61,142.24 35.61,142.44 35.53,142.53 FTDI.15
VBUS
  Bottom 0.305: J1.1 28.7,143.98 C2.1 28.28,142.38 30.56,140.11 37.03,140.11 38.78,141.85 FTDI.20
VDD
  Bottom 0.305: R17.2 PWR_SERVO_OUT.2
  pour Top (isolate 0.406, rank 6, no thermals): 0,150 60,150 60,0 0,0

### Text on the board
tPlace: SCL | SDA | SDA | SCL | SCL | SDA | SDA | SCL | 3.3V / 1A | 5V / 1A | 6V / 15A | SCL | SDA | SDA | SCL | + | - | + | - | - | + | REG_IN | BAT_IN | REG_OUT
bPlace: EN | IO0 | HeRo Mini | Mainboard v0.1 | https://github.com/xXAM22Xx/HeRo-Mini
tNames: HeRo Mini | Mainboard v0.1 | https://github.com/xXAM22Xx/HeRo-Mini